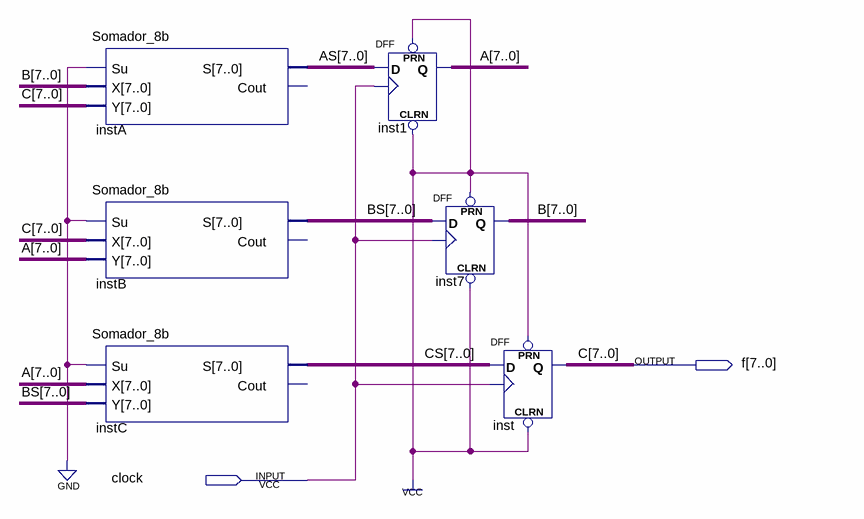
[diagram p0: schematic sheet]
// Quartus schematic Questao09.bdf as structural Verilog: 6 symbols, 2 pins
module Questao09 (
  input  clock,
  output [7:0] f
);

  wire [7:0] A, AS, B, BS, CS;

  Somador_8b instA (.Su(1'b0), .X(B), .Y(f), .S(AS));  // open: Cout
  Somador_8b instB (.Su(1'b0), .X(f), .Y(A), .S(BS));  // open: Cout
  Somador_8b instC (.Su(1'b0), .X(A), .Y(BS), .S(CS));  // open: Cout
  DFF inst1[7:0] (.CLRN(1'b1), .CLK(clock), .D(AS), .PRN(1'b1), .Q(A));
  DFF inst7[7:0] (.CLRN(1'b1), .CLK(clock), .D(BS), .PRN(1'b1), .Q(B));
  DFF inst[7:0] (.CLRN(1'b1), .CLK(clock), .D(CS), .PRN(1'b1), .Q(f));

  // Other names for the same wires on the sheet: C[7:0] = f
endmodule
